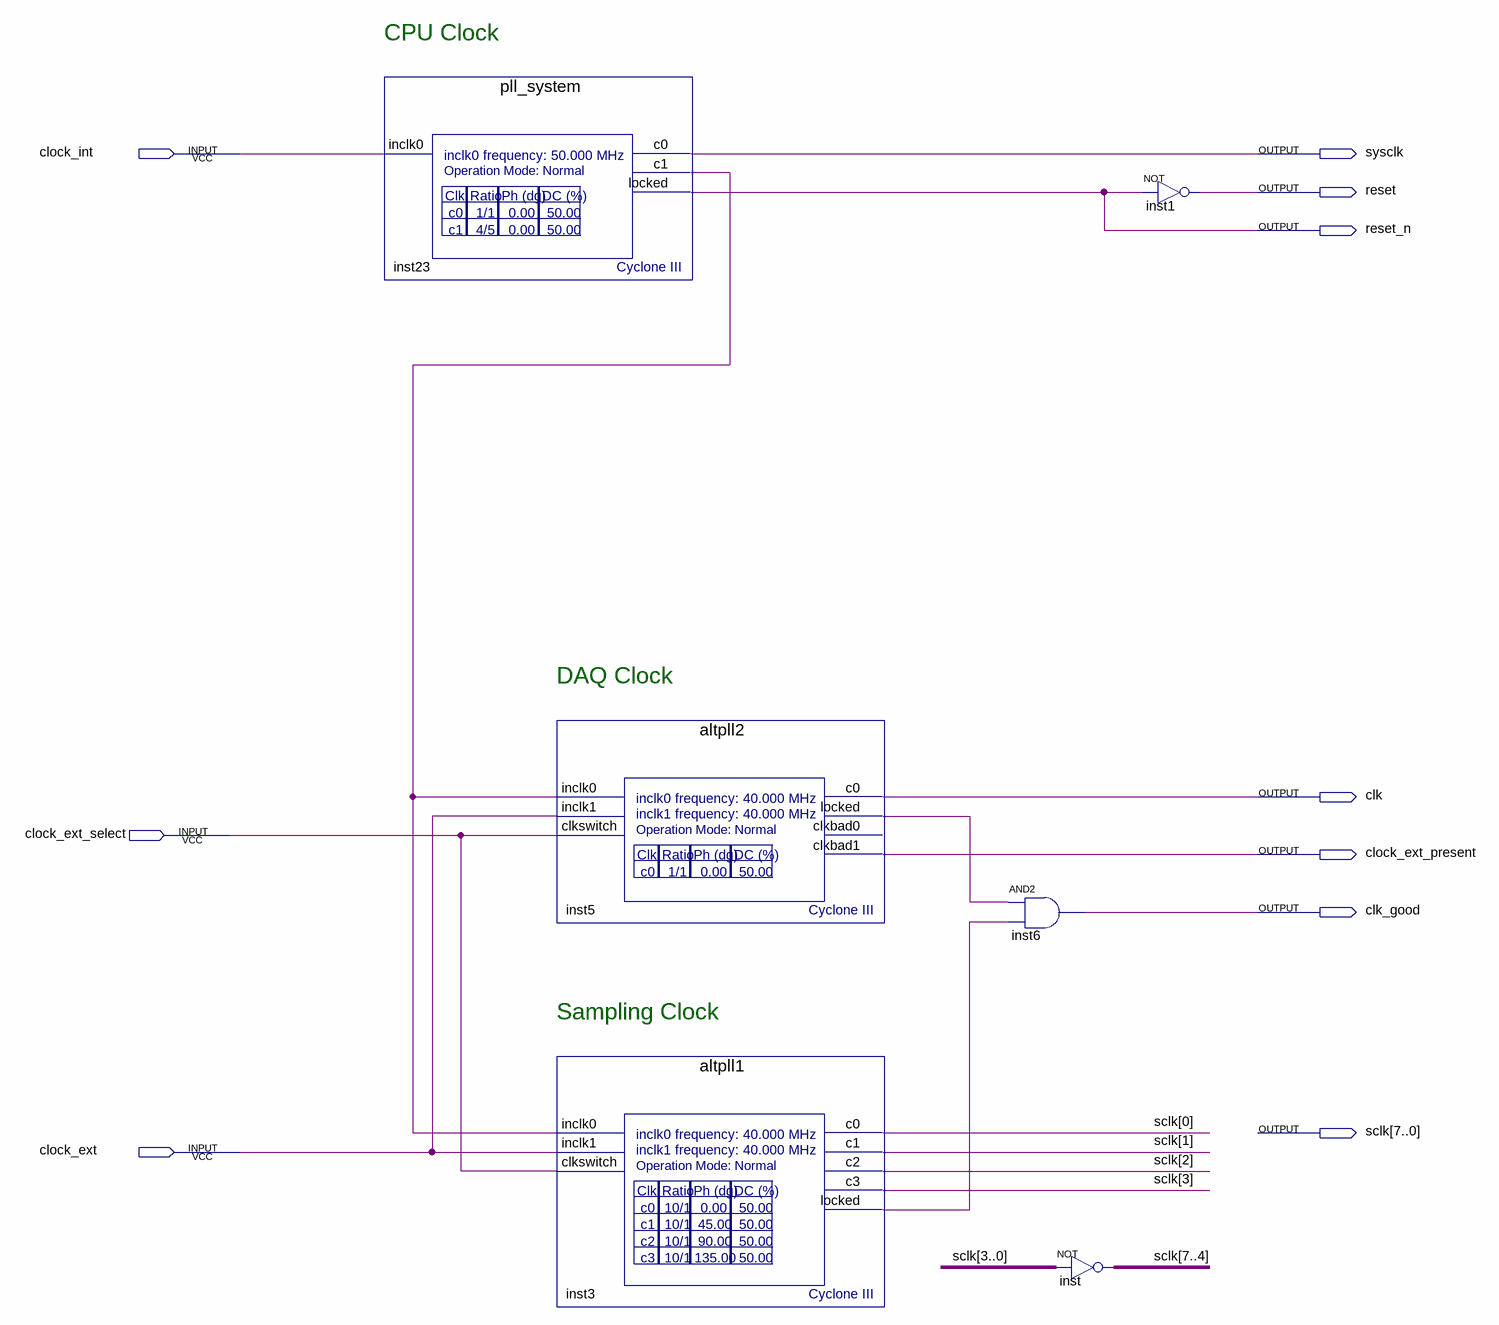
[diagram p0: schematic sheet]
// Quartus schematic clocks_no_ethernet.bdf as structural Verilog: 6 symbols, 10 pins
module clocks_no_ethernet (
  input  clock_int,
  input  clock_ext_select,
  input  clock_ext,
  output sysclk,
  output reset,
  output reset_n,
  output clk,
  output clock_ext_present,
  output clk_good,
  output [7:0] sclk
);

  wire inst3_locked, inst5_locked, inst23_c1;

  pll_system inst23 (.inclk0(clock_int), .c0(sysclk), .c1(inst23_c1), .locked(reset_n));
  altpll2 inst5 (
    .inclk0(inst23_c1), .inclk1(clock_ext), .clkswitch(clock_ext_select), .c0(clk), .locked(inst5_locked),
    .clkbad1(clock_ext_present));  // open: clkbad0
  altpll1 inst3 (
    .inclk0(inst23_c1), .inclk1(clock_ext), .clkswitch(clock_ext_select), .c0(sclk[0]), .c1(sclk[1]),
    .c2(sclk[2]), .c3(sclk[3]), .locked(inst3_locked));
  and inst6 (clk_good, inst5_locked, inst3_locked);
  assign sclk[7:4] = ~sclk[3:0];  // NOT inst, 4 bits wide
  not inst1 (reset, reset_n);

  // Notes on the sheet:
  //   CPU Clock
  //   DAQ Clock
  //   Sampling Clock
endmodule
